# EAGLE design longranger_led-001 (EAGLE 8.6.3)
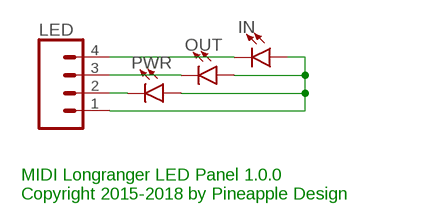
[diagram p0: schematic, sheet 1]

## Parts
IN  LED3MM  [LED_3MM]
LED  CONN_04JST-PTH-VERT  [JST-4-PTH-VERT]
OUT  LED3MM  [LED_3MM]
PWR  LED3MM  [LED_3MM]

## Nets
N$5: LED.2 PWR.K(C)
N$11: LED.3 OUT.K(C)
N$12: IN.K(C) LED.4
PWR: IN.A LED.1 OUT.A PWR.A

## Notes on the sheet
- MIDI Longranger LED Panel 1.0.0
  Copyright 2015-2018 by Pineapple Design

## Library data of the parts
IN OUT PWR = SparkFun-LED:LED: LED (Generic) Standard schematic elements and footprints for 5mm, 3mm, 1206, and 0603 sized LEDs. Generic LEDs with no color specified.; PROD_ID: DIO-08794
LED = SparkFun-Connectors:CONN_04: Multi connection point. Often used as Generic Header-pin footprint for 0.1 inch spaced/style header connections On any of the 0.1 inch spaced packages, you can populate with these: Break Away Headers - Straight <https://www.sparkfun.com/products/116> (PRT-00116) Break Away Male Headers - Right Angle <https://www.sparkfun.com/products/553> (PRT-00553) Female Headers <https://www.sparkfun.com/products/115> (PRT-00115) Break Away Headers - Machine Pin <https://www.sparkfun.com/products/117> (PRT-00117) Break Away Female Headers - Swiss Machine Pin <https://www.sparkfun.com/products/743> (PRT-00743) For SCREWTERMINALS and SPRING TERMINALS visit here: Screw Terimnals on SparkFun.com <https://www.sparkfun.com/search/results?term=Screw+Terminals> (5mm/3.5mm/2.54mm spacing) This device is also useful as a general connection point to wire up your design to another part of your project. Our various solder wires solder well into these plated through hole pads. Hook-Up Wire - Assortment (Stranded, 22 AWG) <https://www.sparkfun.com/products/11375> (PRT-11375) Hook-Up Wire - Assortment (Solid Core, 22 AWG) <https://www.sparkfun.com/products/11367> (PRT-11367) View the entire wire category on our website here <https://www.sparkfun.com/categories/141> Special notes: Molex polarized connector foot print use with SKU : PRT-08231 with associated crimp pins and housings. 1MM SMD Version SKU: PRT-10208; PROD_ID: CONN-13251

## Net classes
0 default: width 0.127 mm, drill 0.127 mm, clearance 0.127 mm

## Board
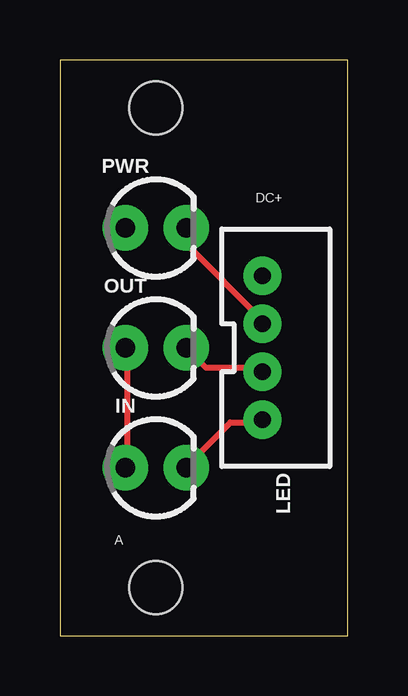
[diagram p1: board, top side]
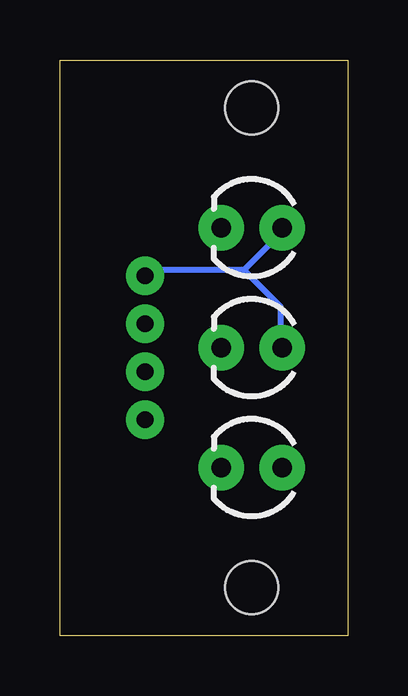
[diagram p2: board, bottom side, seen from below]

Size 12 x 24 mm. Coordinates in mm from the lower left corner, seen from the top.
Outline: 0,0 12,0 12,24 0,24 0,0
Copper layers (1*16): Top 0.035mm / dielectric 1.5mm / Bottom 0.035mm
Design rules "default *": minimum track width 10mil, minimum drill 24mil, track to track 10mil, track to pad 10mil, pad to pad 10mil, via to via 10mil, smd to smd 8mil, copper to edge 40mil, drill to drill 8mil, minimum pad ring 10mil, minimum via ring 8mil, stop-mask expansion 4mil, vias tented up to drill 0mil, thermal gap 10mil
Holes 2.2 mm at 4,2 4,22

### Footprints (pad centres in the part's own frame; a part is rotated, then mirrored left to right if it is on the bottom)
LED_3MM = drill 0.813 pad 1.88: A -1.27,0; K 1.27,0
JST-4-PTH-VERT = drill 0.7 pad 1.6: 1 -3,-0.55; 2 -1,-0.55; 3 1,-0.55; 4 3,-0.55

### Placement (x,y rotation side)
IN  4,7 0 top
LED  9,12 270 top
OUT  4,12 0 top
PWR  4,17 0 top

### Tracks (layer width: path | path; a pad name or v marks a point on that pad's centre or on a via)
N$5
  Top 0.254: LED.2 8.38,13.21 5.33,16.26 5.33,16.76 PWR.K
N$11
  Top 0.254: LED.3 8.38,11.18 6.1,11.18 5.33,11.94 OUT.K
N$12
  Top 0.254: LED.4 8.38,8.89 7.11,8.89 5.33,7.11 IN.K
PWR
  Top 0.254: IN.A 2.79,7.11 2.79,11.94 OUT.A
  Bottom 0.254: 4.32,15.24 8.38,15.24 LED.1 | 4.32,15.24 2.79,16.76 PWR.A | 4.32,15.24 2.79,13.72 2.79,12.19 OUT.A

### Text on the board
tNames: DC+ | A